# Altium project Sensor_node.PrjPcb
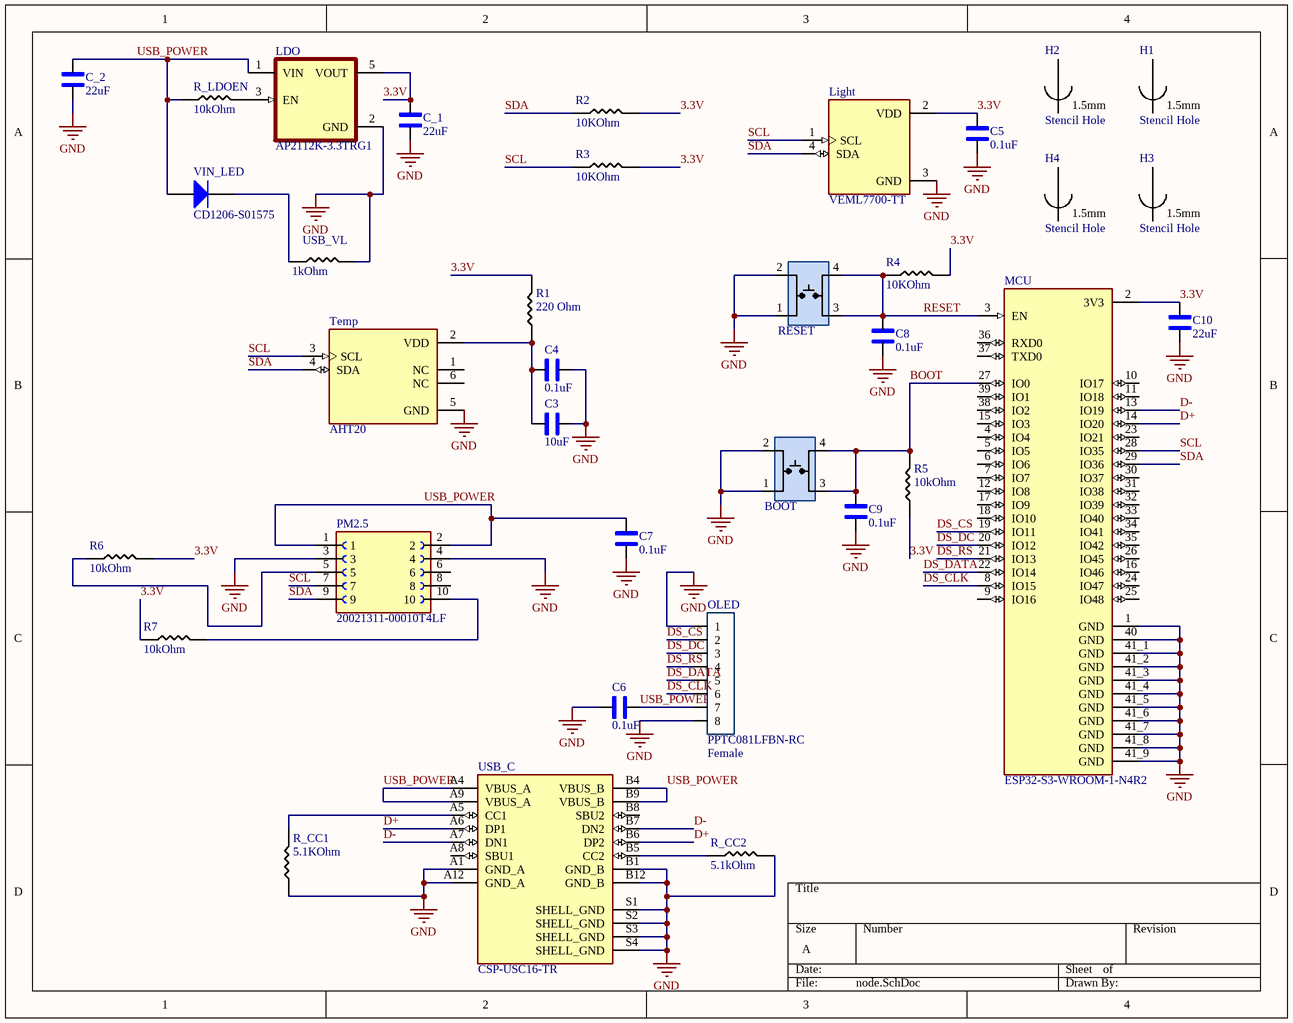
[diagram p0: node.SchDoc]
1 sheet, 35 parts. Net scope: global (net labels, ports and power ports of the same name join across sheets).
Board file: node.PcbDoc

## Sheet node.SchDoc
size A; SheetNumber: 1; SheetTotal: 1

### Parts
BOOT  TL3305AF160QG  [Switch_JLC]  (value not drawn)
C3  10uF  [1206_Passive_Capacitor]
C4  value 0.1uF  [1206_Passive_Capacitor]  (hidden comment: 10uF)
C5  value 0.1uF  [1206_Passive_Capacitor]  (hidden comment: 10uF)
C6  value 0.1uF  [1206_Passive_Capacitor]  (hidden comment: 10uF)
C7  value 0.1uF  [1206_Passive_Capacitor]  (hidden comment: 10uF)
C8  value 0.1uF  [1206_Passive_Capacitor]  (hidden comment: 10uF)
C9  value 0.1uF  [1206_Passive_Capacitor]  (hidden comment: 10uF)
C10  value 22uF  [1206_Passive_Capacitor]  (hidden comment: 10uF)
C_1  22uF  [1206_Passive_Capacitor]
C_2  22uF  [1206_Passive_Capacitor]
H1  Stencil Hole  [AlignmentHole_1.5mm]
H2  Stencil Hole  [AlignmentHole_1.5mm]
H3  Stencil Hole  [AlignmentHole_1.5mm]
H4  Stencil Hole  [AlignmentHole_1.5mm]
LDO  AP2112K-3.3TRG1  [SOT95P285X140-5N]
Light  VEML7700-TT  [XDCR_VEML7700-TT]
MCU  ESP32-S3-WROOM-1-N4R2  [XCVR_ESP32-S3-WROOM-1-N4R2]
OLED  PPTC081LFBN-RC  value Female  [8_PIN_100MIL - Female]
PM2.5  20021311-00010T4LF  [AMPHENOL_20021311-00010T4LF]
R1  220 Ohm  [1206_Passive_Resitor]
R2  value 10KOhm  [1206_Passive_Resitor]  (hidden comment: 10k)
R3  value 10KOhm  [1206_Passive_Resitor]  (hidden comment: 10k)
R4  value 10KOhm  [1206_Passive_Resitor]  (hidden comment: 10k)
R5  value 10kOhm  [1206_Passive_Resitor]  (hidden comment: 220 Ohm)
R6  value 10kOhm  [1206_Passive_Resitor]  (hidden comment: 220 Ohm)
R7  value 10kOhm  [1206_Passive_Resitor]  (hidden comment: 220 Ohm)
R_CC1  value 5.1KOhm  [1206_Passive_Resitor]  (hidden comment: 100KOhm)
R_CC2  value 5.1kOhm  [1206_Passive_Resitor]  (hidden comment: 100KOhm)
R_LDOEN  value 10kOhm  [1206_Passive_Resitor]  (hidden comment: 1 Ohm)
RESET  TL3305AF160QG  [Switch_JLC]  (value not drawn)
Temp  AHT20  [PSON100P300X300X110-6N]
USB_C  CSP-USC16-TR  [VALCON_CSP-USC16-TR]
USB_VL  value 1kOhm  [1206_Passive_Resitor]  (hidden comment: 100Ohm)
VIN_LED  CD1206-S01575  [BOUR-CD1206-S01575-2_L]

### Nets
GND: BOOT.1 BOOT.2 C3.2 C4.2 C5.1 C6.1 C7.1 C8.1 C9.1 C10.1 C_1.1 C_2.1 LDO.2(GND) Light.3(GND) MCU.1(GND) MCU.40(GND) MCU.41_1(GND) MCU.41_2(GND) MCU.41_3(GND) MCU.41_4(GND) MCU.41_5(GND) MCU.41_6(GND) MCU.41_7(GND) MCU.41_8(GND) MCU.41_9(GND) OLED.1 OLED.8 PM2.5.3 PM2.5.4 R_CC1.1 R_CC2.2 RESET.1 RESET.2 Temp.5(GND) USB_C.A1(GND_A) USB_C.A12(GND_A) USB_C.B1(GND_B) USB_C.B12(GND_B) USB_C.S1(SHELL_GND) USB_C.S2(SHELL_GND) USB_C.S3(SHELL_GND) USB_C.S4(SHELL_GND) USB_VL.2
3.3V: C5.2 C10.2 C_1.2 LDO.5(VOUT) Light.2(VDD) MCU.2(3V3) R1.2 R2.2 R3.2 R4.2 R5.1 R6.2 R7.1
BOOT: BOOT.3 BOOT.4 C9.2 MCU.27(IO0) R5.2
D+: MCU.14(IO20) USB_C.A6(DP1) USB_C.B6(DP2)
D-: MCU.13(IO19) USB_C.A7(DN1) USB_C.B7(DN2)
DS_CLK: MCU.8(IO15) OLED.6
DS_CS: MCU.19(IO11) OLED.2
DS_DATA: MCU.22(IO14) OLED.5
DS_DC: MCU.20(IO12) OLED.3
DS_RS: MCU.21(IO13) OLED.4
RESET: C8.2 MCU.3(EN) R4.1 RESET.3 RESET.4
SCL: Light.1(SCL) MCU.28(IO35) PM2.5.7 R3.1 Temp.3(SCL)
SDA: Light.4(SDA) MCU.29(IO36) PM2.5.9 R2.1 Temp.4(SDA)
USB_POWER: C6.2 C7.2 C_2.2 LDO.1(VIN) OLED.7 PM2.5.1 PM2.5.2 R_LDOEN.1 USB_C.A4(VBUS_A) USB_C.A9(VBUS_A) USB_C.B4(VBUS_B) USB_C.B9(VBUS_B) VIN_LED.1(A)
NetC3_1: C3.1 C4.1 R1.1 Temp.2(VDD)
NetLDO_3: LDO.3(EN) R_LDOEN.2
NetPM2.5_5: PM2.5.5 R6.1
NetPM2.5_10: PM2.5.10 R7.2
NetR_CC1_2: R_CC1.2 USB_C.A5(CC1)
NetR_CC2_1: R_CC2.1 USB_C.B5(CC2)
NetUSB_VL_1: USB_VL.1 VIN_LED.2(K)

Not connected (* = marked no-connect by the designer): MCU 4(IO4) 5(IO5) 6(IO6) 7(IO7) 9(IO16) 10(IO17) 11(IO18) 12(IO8) 15(IO3) 16(IO46) 17(IO9) 18(IO10) 23(IO21) 24(IO47) 25(IO48) 26(IO45) 30(IO37) 31(IO38) 32(IO39) 33(IO40) 34(IO41) 35(IO42) 36(RXD0) 37(TXD0) 38(IO2) 39(IO1); PM2.5 6 8; Temp 1(NC) 6(NC); USB_C A8(SBU1) B8(SBU2)

### Notes on the sheet
- (in symbol H_StencilAllignment_1.5mm) 1.5mm

### Library data of the parts
BOOT RESET = SW_Push_Button_JLC: Tactile Switch SPST-NO Top Actuated Surface Mount; MFR Part #: KH-4.5X4.5X4.3H-STM; LCSC Part#: C2837550; Type: Extended; DataSheet: https://datasheet.lcsc.com/lcsc/2106081532_Shenzhen-Kinghelm-Elec-KH-4.5X4.5X4.3H-STM_C2837550.pdf
C3-C10 = C_10uF_1206: 10uF ±10% 50V X5R 1206 Multilayer Ceramic Capacitors MLCC - SMD/SMT RoHS; MFR Part #: CL31A106KBHNNNE; Type: Basic; LCSC Part#: C13585; Datasheet: https://datasheet.lcsc.com/lcsc/1810221112_Samsung-Electro-Mechanics-CL31A106KBHNNNE_C13585.pdf
  C3: Value: 10uF
C_1 C_2 = C_22uF_1206: 22uF ±10% 25V X5R 1206 Multilayer Ceramic Capacitors MLCC - SMD/SMT RoHS; MFR Part #: CL31A226KAHNNNE; LCSC Part#: C12891; Datasheet: https://datasheet.lcsc.com/lcsc/1811031514_Samsung-Electro-Mechanics-CL31A226KAHNNNE_C12891.pdf; Type: basic; Value: 22uF
H1-H4 = H_StencilAllignment_1.5mm: Stencil Allignment hole for use with 1.5mm pin
LDO = AP2112K-3.3TRG1: AP2112 Series 0.6 A 3.3 V Fixed Output SMT LDO Linear Regulator - SOT23-5; MF: {'manufacturer': u'Diodes Inc.'}; Price: None; MP: AP2112K-3.3TRG1; Availability: Unavailable; Package: None; Value: *
Light = VEML7700-TT: MF: {'manufacturer': u'Vishay Semiconductor'}; Package: None; Price: None; Value: *; MP: VEML7700-TT; Availability: Unavailable
MCU = ESP32-S3-WROOM-1-N4R2: MF: {'manufacturer': u'Espressif Systems'}; Package: None; Price: None; Value: *; MP: ESP32-S3-WROOM-1-N4R2; Availability: Unavailable
OLED = JF_8_PIN_FEMALE: 8 Position Header Connector 0.100" (2.54mm) Through Hole Tin; Digikey Link: https://www.digikey.com/product-detail/en/PPTC081LFBN-RC/S7006-ND/810147/?itemSeq=304982354; MFR Part #: PPTC081LFBN-RC; Type: Extended; LCSC Part#: C27438
PM2.5 = 20021311-00010T4LF: MF: {'manufacturer': u'Amphenol ICC'}; Package: None; Price: None; Value: *; MP: 20021311-00010T4LF; Availability: Unavailable
R1 R5-R7 = R_0Ohm_1206: CHIP RESISTOR - SURFACE MOUNT 0OHMS ±1% 1/4W 1206 ROHS; MFR Part #: 1206W4F0000T5E; Datasheet: https://datasheet.lcsc.com/szlcsc/Uniroyal-Elec-1206W4F0000T5E_C17888.pdf; LCSC Part#: C17888; Type: Basic; Mouser link: https://www.mouser.com/ProductDetail/Royalohm/1206W4F0000T5E?qs=e8oIoAS2J1Thbopin%252BsagQ%3D%3D
  R1: Value: 220 Ohm
R2-R4 = R_10KOhm_1206: 10 kOhms ±5% 0.25W, 1/4W Chip Resistor 1206 (3216 Metric) Automotive AEC-Q200 Thick Film; MFR Part #: RMCF1206FT10K0; Digikey Link: https://www.digikey.com/en/products/detail/stackpole-electronics-inc/RMCF1206FT10K0/1759669; LCSC Part#: C17902; Type: Basic
R_CC1 R_CC2 = R_100KOhm_1206: 100kΩ ±1% 0.25W ±100ppm/℃ 1206 Chip Resistor - Surface Mount RoHS; MFR Part #: 1206W4F1003T5E; LCSC Part#: C17900; Datasheet: https://datasheet.lcsc.com/lcsc/1810301421_UNI-ROYAL-Uniroyal-Elec-1206W4F1003T5E_C17900.pdf; Type: Basic
R_LDOEN = R_1Ohm_1206: 1Ω ±5% 0.25W ±400ppm/℃ 1206 Chip Resistor - Surface Mount RoHS; MFR Part #: 1206W4J010JT5E; LCSC Part#: C1409; Datasheet: https://datasheet.lcsc.com/lcsc/1810301410_UNI-ROYAL-Uniroyal-Elec-1206W4J010JT5E_C1409.pdf; Type: Extended
Temp = AHT20: Temperature and Humidity sensor; MF: {'manufacturer': u'Asair'}; Package: None; Price: None; Value: *; MP: AHT20; Availability: Unavailable
USB_C = CSP-USC16-TR: MF: {'manufacturer': u'Valcon'}; Value: *; MP: CSP-USC16-TR; Availability: Unavailable; Package: None; Price: None
USB_VL = R_100Ohm_1206: 100Ω ±1% 0.25W ±100ppm/℃ 1206 Chip Resistor - Surface Mount RoHS; MFR Part #: 1206W4F1000T5E; LCSC Part#: C17901; Datasheet: https://datasheet.lcsc.com/lcsc/2206010145_UNI-ROYAL-Uniroyal-Elec-1206W4F1000T5E_C17901.pdf; Type: Basic
VIN_LED = CMP-0583-00001-2: 75 V Small Signal Switching Diode, 150 mA, 2.5 uA, 1026 Molded Package, RoHS, Tape and Reel; Manufacturer: Bourns; Reverse Voltage: 75 V; Average Forward Current: 150 mA; Reverse Current (Max.): 2.5 uA; Capacitance Between Terminals (Max.): 3 pF; Reverse Recovery Time (Max.): 4 nS; Forward Voltage (Max.): 1.00 V; Packing: Tape and Reel; Mounting Technology: Surface Mount; DatasheetVersion: Rev. 06/11; ComponentLink2URL: http://www.bourns.com/data/global/pdfs/CD1206_S01575.pdf; PackageReference: CD1206-S01575-2; RoHS: TRUE; ComponentLink1URL: http://www.bourns.com/; ComponentLink1Description: Manufacturer URL; ComponentLink3Description: Package Specification; ComponentLink3URL: http://www.bourns.com/data/global/pdfs/CD1206_S01575.pdf; ComponentLink2Description: Datasheet; PackageDescription: 2-Pin SMD, Body 3.2 x 1.5 mm; PartNumber: CD1206-S01575